# Altium schematic sheet Mechanics.SchDoc: EEM_PWR_MOD_AC
size A4
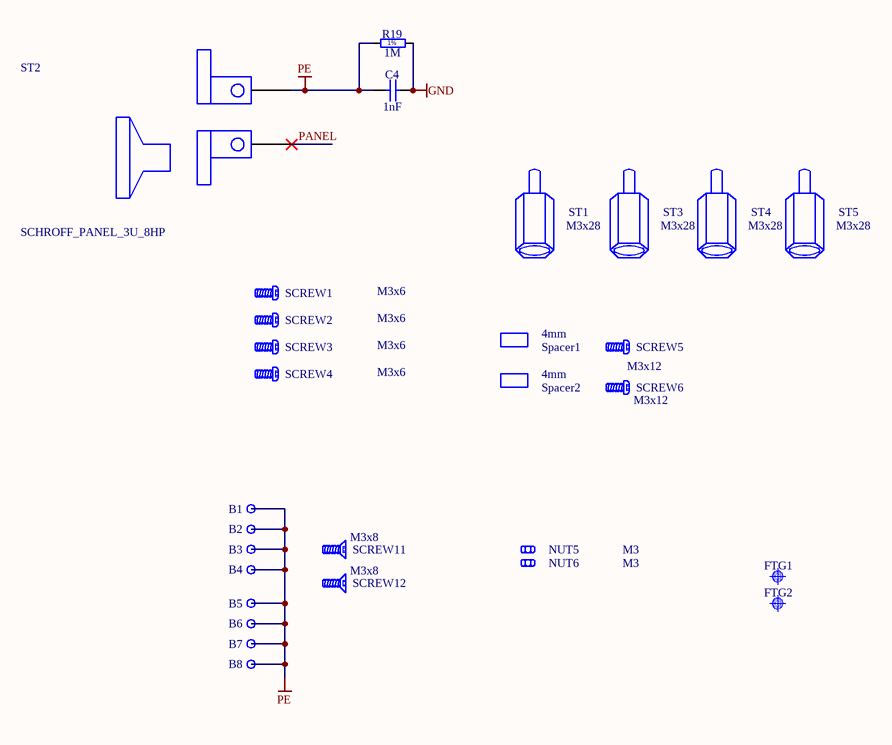
[diagram p0: Mechanics.SchDoc]

## Parts
B1  Plated Hole  [MTG320_700]  (value not drawn)  (no BOM)
B2  Plated Hole  [MTG320_700]  (value not drawn)  (no BOM)
B3  Plated Hole  [MTG320_700]  (value not drawn)  (no BOM)
B4  Plated Hole  [MTG320_700]  (value not drawn)  (no BOM)
B5  Plated Hole  [MTG350_650]  (value not drawn)  (no BOM)
B6  Plated Hole  [MTG350_650]  (value not drawn)  (no BOM)
B7  Plated Hole  [MTG350_650]  (value not drawn)  (no BOM)
B8  Plated Hole  [MTG350_650]  (value not drawn)  (no BOM)
C4  1nF  [CAPC3216X180N]
FTG1  Use only in PCB  [FIDUCIAL_TOP_C100-200]  (value not drawn)
FTG2  Use only in PCB  [FIDUCIAL_TOP_S100-200]  (value not drawn)
NUT5  M3  [BOSSARD_BN628-1241443_v]
NUT6  M3  [BOSSARD_BN628-1241443_v]
R19  1M  [RESC3216X65N]
SCREW1  M3x6  [BOSSARD_BN5687-3061605_v]
SCREW2  M3x6  [BOSSARD_BN5687-3061605_v]
SCREW3  M3x6  [BOSSARD_BN5687-3061605_v]
SCREW4  M3x6  [BOSSARD_BN5687-3061605_v]
SCREW5  M3x12  [BOSSARD_BN5687-3061609_v]
SCREW6  M3x12  [BOSSARD_BN5687-3061609_v]
SCREW11  M3x8  [OSSARD_M3X8/BN3327_h]
SCREW12  M3x8  [OSSARD_M3X8/BN3327_h]
Spacer1  4mm  [DREMEC_DR316/3.2X4]
Spacer2  4mm  [DREMEC_DR316/3.2X4]
ST1  M3x28  [Ettinger-M3X28_05.13.281_rev]
ST2  SCHROFF_PANEL_3U_8HP  [Schroff 30848430]
ST3  M3x28  [Ettinger-M3X28_05.13.281_rev]
ST4  M3x28  [Ettinger-M3X28_05.13.281_rev]
ST5  M3x28  [Ettinger-M3X28_05.13.281_rev]

## Nets
GND: C4.2 R19.2
PE: B1.1 B2.1 B3.1 B4.1 B5.1 B6.1 B7.1 B8.1 C4.1 R19.1 ST2.1
PANEL: ST2.2

## Notes on the sheet
- (in symbol R1206_1M_1%_0.25W_100PPM) 1%

## Library data of the parts
B1-B4 = PLATED_HOLE3.2_PAD7.0: Single Terminal Socket; Part Description: Plated Through Hole: Hole Dia.=3.2mm Pad Dia.=7.0mm; Mounted: No; Part Number: PLATED_HOLE3.2_PAD7.0; Component Type: Standard (No BOM); Pin Count: 1; Family: Plated Hole; Socket: No; SMD: No; Sense: No; Status: None; ComponentHeight: 0mm; HelpURL: Undefined; Author: CERN DEM JMW; CreateDate: 28.11.2017; LatestRevisionDate: 28.11.2017; PackageDescription: Plated Through Hole: Hole Dia.=3.2mm Pad Dia.=7.0mm; ClassName: Overlapping
B5-B8 = PLATED_HOLE3.5_PAD6.5: Single Terminal Socket; Part Description: Plated Through Hole: Hole Dia.=3.5mm Pad Dia.=6.5mm; Mounted: No; Part Number: PLATED_HOLE3.5_PAD6.5; Component Type: Standard (No BOM); Pin Count: 1; Family: Plated Hole; Socket: No; SMD: No; Sense: No; Status: None; ComponentHeight: 0mm; HelpURL: Undefined; Author: CERN DEM JLC; CreateDate: 20.11.2008; LatestRevisionDate: 23.11.2011; PackageDescription: Plated Through Hole: Hole Dia.=3.5mm Pad Dia.=6.5mm; ClassName: Overlapping
C4 = CC1206_1NF_2KV_10%_X7R: Non-polarised capacitor; Part Description: High Voltage MLC Chip Capacitor; Manufacturer: GENERIC; Manufacturer1 Part Number: 1206GC102KAT2A; Voltage: 2kV; TC: X7R; Tolerance: ±10%; Part Number: CC1206_1NF_2KV_10%_X7R; Component Kind: Standard; Component Type: Standard; Pin Count: 2; Value: 1nF; Status: None; Manufacturer Part Number: CC1206_1NF_2KV_10%_X7R; Case: 1206; Mounted: Yes; Socket: No; SMD: Yes; Sense: No; Manufacturer1 Example: AVX; Manufacturer1 ComponentHeight: 1.8mm; HelpURL: \\cern.ch\dfs\Applications\Altium\Datasheets\CC1206_X7R_AVX_HV-MLC.pdf; Author: CERN DEM JLC; CreateDate: 19.11.2012; LatestRevisionDate: 17.05.2017
FTG1 = FIDUCIAL_TARGET_C100-200: Fiducial Target; Part Description: Round Fiducial Target, Top Layer, 1.0mm, Top Solder 2.0mm, Keepout =2.0mm; Mounted: No; Part Number: FIDUCIAL_TARGET_C100-200; Component Kind: Standard (No BOM); Component Type: Standard (No BOM); Pin Count: 1; Family: Fiducial; Socket: No; SMD: Yes; Sense: No; Status: None; ComponentHeight: 0mm; HelpURL: Undefined; Author: CERN DEM JLC; CreateDate: 09.02.2010; LatestRevisionDate: 04.04.2012; PackageDescription: Round Fiducial Target, Top Layer, 1.0mm, Top Solder 2.0mm, Keepout =2.0mm
FTG2 = FIDUCIAL_TARGET_S100-200: Fiducial Target; Part Description: Square Fiducial Target, Top Layer, 1.0mm, Top Solder 2.0mm, Keepout =2.0mm; Mounted: No; Part Number: FIDUCIAL_TARGET_S100-200; Component Kind: Standard (No BOM); Component Type: Standard (No BOM); Pin Count: 1; Family: Fiducial; Socket: No; SMD: Yes; Sense: No; Status: None; ComponentHeight: 0mm; HelpURL: Undefined; Author: CERN DEM JLC; CreateDate: 09.02.2010; LatestRevisionDate: 04.04.2012; PackageDescription: Square Fiducial Target, Top Layer, 1.0mm, Top Solder 2.0mm, Keepout =2.0mm
NUT5 NUT6 = BOSSARD_BN628-1241443_v: Nut; Part Description: M3 Hexagon Nut ~0,8d, ISO 4032, DIN 934, Stainless Steel A2; Manufacturer Part Number: BN628 Art.1241443; PressFit: No; Part Number: BOSSARD_BN628-1241443_v; Component Kind: Standard; Component Type: Mechanical; Pin Count: 0; PackageDescription: M3 Hexagon Nut ~0,8d, ISO 4032, DIN 934, Stainless Steel A2; Mounted: Yes; Socket: No; SMD: No; Sense: No; Status: None; Value: M3; Manufacturer: BOSSARD; ComponentHeight: 2.4mm; HelpURL: \\cern.ch\dfs\Applications\Altium\Datasheets\BOSSARD_BN628-1241443.pdf; Author: CERN DEM JMW; CreateDate: 04/12/2015; LatestRevisionDate: 04/12/2015; ClassName: Overlapping
R19 = R1206_1M_1%_0.25W_100PPM: Resistor - 1%; Part Description: General Purpose Thick Film Chip Resistor; Manufacturer: GENERIC; Manufacturer1 Part Number: NRC12F1004TRF; Power: 0.25W; TC: ±100ppm/°C; PressFit: No; Part Number: R1206_1M_1%_0.25W_100PPM; Component Kind: Standard; Component Type: Standard; Pin Count: 2; Value: 1M; Status: Preferred; Tolerance: ±1%; Manufacturer Part Number: R1206_1M_1%_0.25W_100PPM; Case: 1206; Mounted: Yes; Sense: No; Socket: No; SMD: Yes; Manufacturer1 Example: NIC COMPONENT; Manufacturer1 ComponentHeight: 0.65mm; HelpURL: \\cern.ch\dfs\Applications\Altium\Datasheets\R1206_NIC_NRC.pdf; Author: CERN DEM JLC; CreateDate: 03.12.2007; LatestRevisionDate: 13.03.2008
SCREW1-SCREW4 = BOSSARD_BN5687-3061605_v: Screw; Part Description: M3 L=6mm Hexalobular Socket Pan Head Screw, Fully Threaded, Stainless Steel A2; Manufacturer Part Number: BN5687 Art.3061605; PressFit: No; Part Number: BOSSARD_BN5687-3061605_v; Component Kind: Standard; Component Type: Mechanical; Pin Count: 0; PackageDescription: M3 L=6mm Hexalobular Socket Pan Head Screw, Fully Threaded - Stainless Steel A2; Mounted: Yes; Socket: No; SMD: No; Sense: No; Status: None; Value: M3x6; Manufacturer: BOSSARD; ComponentHeight: 2.4mm; HelpURL: \\cern.ch\dfs\Applications\Altium\Datasheets\BOSSARD_BN5687-3061605.pdf; Author: CERN DEM JLC; CreateDate: 15/01/2013; LatestRevisionDate: 15/01/2013
SCREW5 SCREW6 = BOSSARD_BN5687-3061609_v: Screw; Part Description: M3 L=12mm Hexalobular Socket Pan Head Screw, Fully Threaded, Stainless Steel A2; Manufacturer Part Number: BN5687 Art.3061609; PressFit: No; Part Number: BOSSARD_BN5687-3061609_v; Component Kind: Standard; Component Type: Mechanical; Pin Count: 0; PackageDescription: M3 L=12mm Hexalobular Socket Pan Head Screw, Fully Threaded - Stainless Steel A2; Mounted: Yes; Socket: No; SMD: No; Sense: No; Status: None; Value: M3x12; Manufacturer: BOSSARD; ComponentHeight: 14.4mm; HelpURL: \\cern.ch\dfs\Applications\Altium\Datasheets\BOSSARD_BN5687-3061609.pdf; Author: CERN DEM JLC; CreateDate: 22/08/2013; LatestRevisionDate: 22/08/2013; ClassName: Overlapping
SCREW11 SCREW12 = Screw_M3x8_Countersunk: Screw; 3x8; Head: countersunk; Pozidriv; A2 stainless steel; Part Number: OSSARD_M3X8/BN3327; Part Description: M3 L=8mm  countersunk; Pozidriv Pan Head Screw, Fully Threaded, Stainless Steel A2; Manufacturer: BOSSARD; Manufacturer Part Number: M3X8/BN3327_h; PressFit: No; Component Kind: Standard; Component Type: Mechanical; Pin Count: 0; PackageDescription: M3 L=8mm Countersunk Posidriv Screw, Fully Threaded - Stainless Steel A2; Mounted: Yes; Socket: No; SMD: No; Sense: No; Status: None; Value: M3x8; ComponentHeight: 5.6mm; HelpURL: \\cern.ch\dfs\Applications\Altium\Datasheets\BOSSARD_BN5687-3061605.pdf; Author: GK; CreateDate: 15/01/2013; LatestRevisionDate: 15/01/2013; ClassName: Overlapping
Spacer1 Spacer2 = MECH_Spacer_3.2x4x6: Metric Female Unthreaded Round Brass Spacer/Pillar, Length 4mm, External Dia. 6mm, Internal Dia. 3.2mm; Manufacturer: DREMEC; Manufacturer Part Number: DR316/3.2X4; Part Number: DREMEC_DR316/3.2X4; Component Kind: Standard; Component Type: Standard; Pin Count: 0; PackageDescription: Metric Female Unthreaded Round Brass Spacer/Pillar, Length 4mm, External Dia. 6mm, Internal Dia. 3.2mm; Mounted: Yes; Socket: No; SMD: No; PressFit: Yes; Sense: No; Status: None; Value: 4mm; Part Description: Metric Female Unthreaded Round Brass Spacer/Pillar, Length 4mm, External Dia. 6mm, Internal Dia. 3.2mm; ComponentHeight: 6mm; HelpURL: \\cern.ch\dfs\Applications\Altium\Datasheets\HARWIN_R6162-02.pdf; Author: GK; CreateDate: 13.09.2017; LatestRevisionDate: 13.09.2017; ClassName: Overlapping
ST1 ST3-ST5 = MECH_Standoff_M3x28_rev: M3x28 standoff; Part Number: Ettinger_05.13.281; Part Description: M3x28 male - female Hex Spacer made of free-machining brass with nickel plated finish; Manufacturer: Ettinger; PressFit: No; Component Kind: Standard; Component Type: Mechanical; Footprint: Ettinger-M3X28_05.13.281; Pin Count: 0; PackageDescription: M3 L=28mm   Fully Threaded - Stainless Steel spacer; Mounted: Yes; Socket: No; SMD: No; Sense: No; Status: None; Value: M3x28; Manufacturer Part Number: 05.13.281; ComponentHeight: 28; HelpURL: \\cern.ch\dfs\Applications\Altium\Datasheets\BOSSARD_BN5687-3061597.pdf; Author: GK; CreateDate: 25.02.2019; LatestRevisionDate: 25.02.2019; ClassName: Overlapping
ST2 = SCHROFF_PANEL_3U_8HP: Schroff 8HP 4U EUROCARD Panel with ejector; Manufacturer Part Number: 30848430